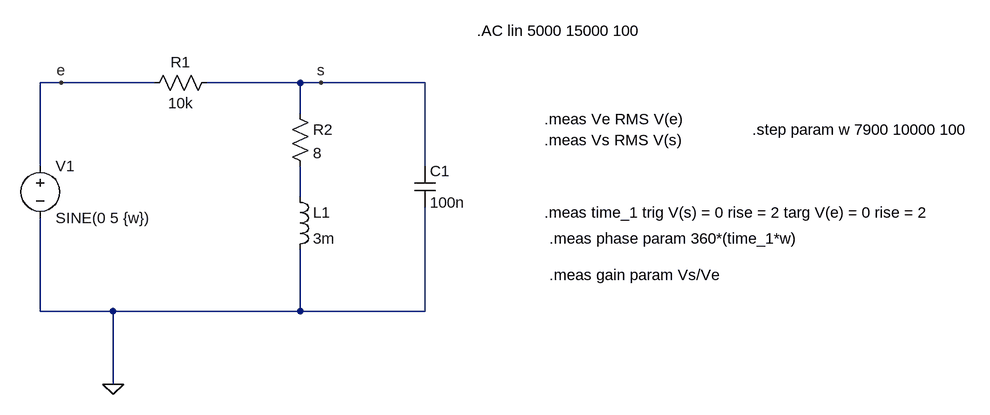
[diagram p0: schematic Exp_6_RLC_WL.asc]
Exp_6_RLC_WL.asc, the LTspice schematic file:
Version 4
SHEET 1 1560 680
WIRE 112 144 80 144
WIRE 256 144 112 144
WIRE 480 144 336 144
WIRE 512 144 480 144
WIRE 672 144 512 144
WIRE 480 192 480 144
WIRE 80 272 80 144
WIRE 672 272 672 144
WIRE 480 320 480 272
WIRE 80 496 80 352
WIRE 192 496 80 496
WIRE 480 496 480 400
WIRE 480 496 192 496
WIRE 672 496 672 336
WIRE 672 496 480 496
WIRE 192 608 192 496
FLAG 192 608 0
FLAG 512 144 s
FLAG 112 144 e
SYMBOL res 352 128 R90
WINDOW 0 0 56 VBottom 2
WINDOW 3 32 56 VTop 2
SYMATTR InstName R1
SYMATTR Value 10k
SYMBOL voltage 80 256 R0
SYMATTR InstName V1
SYMATTR Value SINE(0 5 {w})
SYMATTR Value2 AC 5
SYMBOL res 464 176 R0
SYMATTR InstName R2
SYMATTR Value 8
SYMBOL ind 464 304 R0
SYMATTR InstName L1
SYMATTR Value 3m
SYMBOL cap 656 272 R0
SYMATTR InstName C1
SYMATTR Value 100n
TEXT 752 64 Left 2 !.AC lin 5000 15000 100
TEXT 856 200 Left 2 !.meas Ve RMS V(e)
TEXT 856 232 Left 2 !.meas Vs RMS V(s)
TEXT 1176 216 Left 2 !.step param w 7900 10000 100
TEXT 856 344 Left 2 !.meas time_1 trig V(s) = 0 rise = 2 targ V(e) = 0 rise = 2
TEXT 864 384 Left 2 !.meas phase param 360*(time_1*w)
TEXT 864 440 Left 2 !.meas gain param Vs/Ve

The netlist it stands for:
* Exp_6_RLC_WL.asc
R1 s e 10k
V1 e 0 SINE(0 5 {w}) AC 5
R2 s N001 8
L1 N001 0 3m
C1 s 0 100n
.AC lin 5000 15000 100
.meas Ve RMS V(e)
.meas Vs RMS V(s)
.step param w 7900 10000 100
.meas time_1 trig V(s) = 0 rise = 2 targ V(e) = 0 rise = 2
.meas phase param 360*(time_1*w)
.meas gain param Vs/Ve
.backanno
.end